# Altium schematic sheet Security.SchDoc
size A3
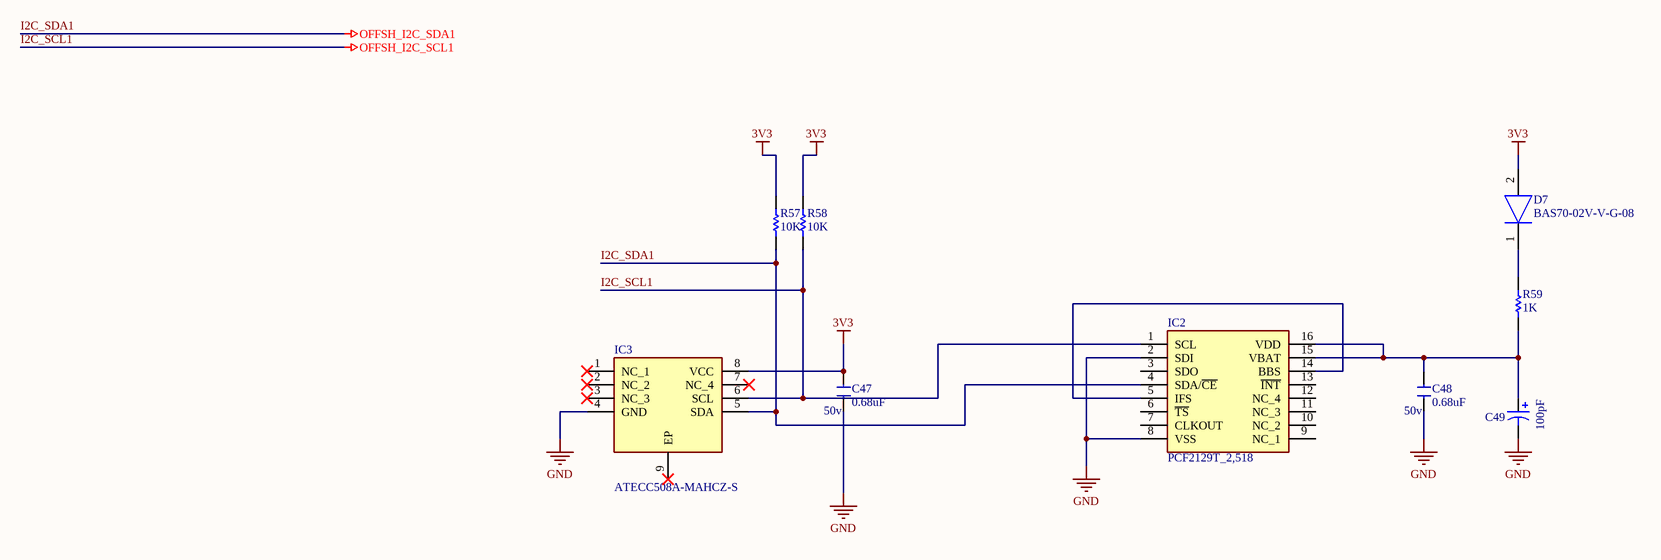
[diagram p0: Security.SchDoc]

## Parts
C47  Voltage: 50v  [0603 Capacitor]  (hidden comment: Capacitor SMD)
C48  Voltage: 50v  [0603 Capacitor]  (hidden comment: Capacitor SMD)
C49  value 100pF  [C0805]  (hidden comment: Cap Pol3)
D7  BAS70-02V-V-G-08  [SODFL1608X70N]
IC2  PCF2129T_2,518  [SOIC127P1032X265-16N]
IC3  ATECC508A-MAHCZ-S  [SON50P300X200X60-9N]
R57  value 10K  [AXIAL-0.3]  (hidden comment: Res1)
R58  value 10K  [AXIAL-0.3]  (hidden comment: Res1)
R59  value 1K  [AXIAL-0.3]  (hidden comment: Res1)

## Nets
3V3: C47.2 D7.2(A) IC3.8(VCC) R57.1 R58.1
GND: C47.1 C48.1 C49.2 IC2.2(SDI) IC2.8(VSS) IC3.4(GND)
I2C_SCL1: IC2.1(SCL) IC3.6(SCL) R58.2  [also labelled OFFSH_I2C_SCL1]
I2C_SDA1: IC2.4(SDA/~{CE}) IC3.5(SDA) R57.2  [also labelled OFFSH_I2C_SDA1]
NetC48_2: C48.2 C49.1 IC2.15(VBAT) IC2.16(VDD) R59.2
NetD7_1: D7.1(K) R59.1
NetIC2_5: IC2.5(IFS) IC2.14(BBS)

Not connected (* = marked no-connect by the designer): IC2 3(SDO) 6(~{TS}) 7(CLKOUT) 9(NC_1) 10(NC_2) 11(NC_3) 12(NC_4) 13(~{INT}); IC3 1(NC_1)* 2(NC_2)* 3(NC_3)* 7(NC_4)* 9(EP)*

## Notes on the sheet
- (in symbol Capacitor SMD) 0.68uF

## Library data of the parts
C49 = Cap Pol3: Polarized Capacitor (Surface Mount); Published: 8-Jun-2000; LatestRevisionDate: 29-May-2009; LatestRevisionNote: IPC-7351 Footprint Added.; PackageReference: C0805; Publisher: Altium Limited; PackageDescription: Chip Capacitor
D7 = BAS70-02V-V-G-08: Diode; Manufacturer_Name: Vishay; Datasheet Link: http://www.vishay.com/docs/82393/bas7002v.pdf; Height: 0.7mm; Manufacturer_Part_Number: BAS70-02V-V-G-08; Mouser Part Number: 78-BAS70-02V-V-G-08; Mouser Price/Stock: https://www.mouser.co.uk/ProductDetail/Vishay-Semiconductors/BAS70-02V-V-G-08?qs=%252BgSy6WSn%2FNx6OtWzB77ZjQ%3D%3D; Arrow Part Number: BAS70-02V-V-G-08; Arrow Price/Stock: https://www.arrow.com/en/products/bas70-02v-v-g-08/vishay
IC2 = PCF2129T_2,518: Integrated Circuit; Manufacturer_Name: NXP; Manufacturer_Part_Number: PCF2129T/2,518; Datasheet Link: http://www.nxp.com/docs/en/data-sheet/PCF2129.pdf; Height: 2.65mm; Mouser Part Number: 771-PCF2129T/2,518; Mouser Price/Stock: https://www.mouser.co.uk/ProductDetail/NXP-Semiconductors/PCF2129T-2518/?qs=O0BhuZj9Wkzo98h9NloC7Q%3D%3D; Arrow Part Number: PCF2129T/2,518; Arrow Price/Stock: https://www.arrow.com/en/products/pcf2129t2518/nxp-semiconductors
IC3 = ATECC508A-MAHCZ-S: Integrated Circuit; Manufacturer_Name: Microchip; Datasheet Link: http://www.mouser.com/ds/2/268/Atmel-8923S-CryptoAuth-ATECC508A-Datasheet-Summary-1065793.pdf; Height: 0.6mm; Manufacturer_Part_Number: ATECC508A-MAHCZ-S; Mouser Part Number: 556-ATECC508AMAHCZS; Mouser Price/Stock: https://www.mouser.co.uk/ProductDetail/Microchip-Technology-Atmel/ATECC508A-MAHCZ-S?qs=%2FPOkb%252BiDxRUOydmISUnqmg%3D%3D; Arrow Part Number: ATECC508A-MAHCZ-S; Arrow Price/Stock: https://www.arrow.com/en/products/atecc508a-mahcz-s/microchip-technology
R57-R59 = Res1: Resistor; Published: 8-Jun-2000; LatestRevisionDate: 17-Jul-2002; LatestRevisionNote: Re-released for DXP Platform.; PackageReference: AXIAL-0.3; Publisher: Altium Limited; PackageDescription: Axial Device, Thru-Hole; 2 Leads; 0.3 in Pin Spacing